# Altium schematic sheet [16]-CLOCK.SchDoc
size A4
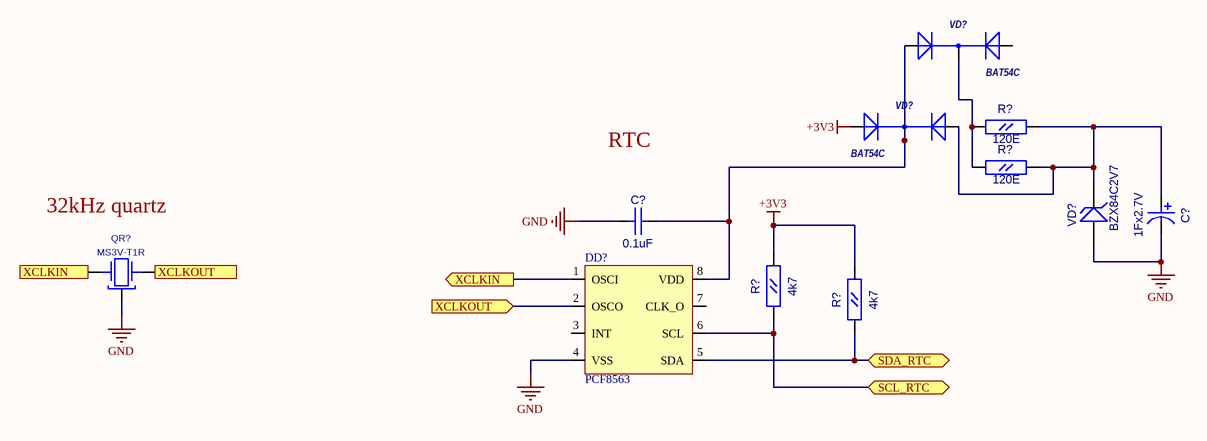
[diagram p0: [16]-CLOCK.SchDoc]

## Parts
(Parts that share a designator on the sheet are numbered #1, #2 ... from top to bottom, then left to right.)
C?#1  1Fx2.7V  [CC8X11.5_L]
C?#2  0.1uF  [CC0603]
DD?  PCF8563  [SO-8]
QR?  MS3V-T1R  [MS3V-T1R]
R?#1  120E  [RC0805]
R?#2  120E  [RC0805]
R?#3  4k7  [RC0603]
R?#4  4k7  [RC0603]
VD?#1  BAT54C  [SOT-23(123)]
VD?#2  BAT54C  [SOT-23(123)]
VD?#3  BZX84C2V7  [SOT-23(123)]

## Ports
SCL_RTC (bidir), SDA_RTC (bidir), XCLKIN (in), XCLKIN (out), XCLKOUT (in), XCLKOUT (out)

## Nets
+3V3: R?#3.2(B) R?#4.2(B) VD?#2.1(A)
GND: C?#1.2 C?#2.1(A) DD?.4(VSS) QR?.3 VD?#3.1(A)
SCL_RTC: DD?.6(SCL) R?#3.1(A) ; port SCL_RTC
SDA_RTC: DD?.5(SDA) R?#4.1(A) ; port SDA_RTC
XCLKIN: DD?.1(OSCI) QR?.2(X2) ; port XCLKIN
XCLKOUT: DD?.2(OSCO) QR?.1(X1) ; port XCLKOUT
NetC?#1_1: C?#1.1 R?#1.2(B) R?#2.2(B) VD?#2.2(A) VD?#3.3(K)
NetC?#2_2: C?#2.2(B) DD?.8(VDD) VD?#1.1(A) VD?#2.3(K)
NetR?#1_1: R?#1.1(A) R?#2.1(A) VD?#1.3(K)

Not connected (* = marked no-connect by the designer): DD? 3(INT) 7(CLK_O); VD?#1 2(A)

## Notes on the sheet
- RTC
- (near QR?) 32kHz quartz

## Library data of the parts
C?#1 = CAP_8mm: Radial capacitor; Value: 1Fx2.7V
C?#2 = CC0603: Value: 0.1uF
QR? = MS3V-T1R: CRYSTAL_32768 Hz; Value: MS3V-T1R
R?#1 R?#2 = RC0805: Value: 120E
R?#3 R?#4 = RC0603: Value: 4k7
VD?#3 = BZX84: Zener Voltage Regulator Diode; Value: BZX84C2V7
DD? = PCF8563: Value: PCF8563
VD?#1 VD?#2 = BAT54C: Value: *